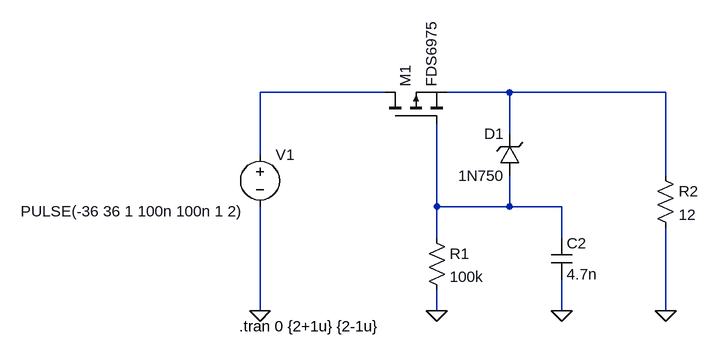
[diagram p0: schematic reverse_polarity_protection.asc]
reverse_polarity_protection.asc, the LTspice schematic file:
Version 4
SHEET 1 880 680
WIRE 80 80 -112 80
WIRE 272 80 176 80
WIRE 512 80 272 80
WIRE 272 144 272 80
WIRE -112 176 -112 80
WIRE 512 208 512 80
WIRE 160 256 160 128
WIRE 272 256 272 208
WIRE 272 256 160 256
WIRE 352 256 272 256
WIRE 160 304 160 256
WIRE 352 304 352 256
WIRE -112 416 -112 256
WIRE 160 416 160 384
WIRE 352 416 352 368
WIRE 512 416 512 288
FLAG 160 416 0
FLAG -112 416 0
FLAG 512 416 0
FLAG 352 416 0
SYMBOL pmos 80 128 R270
SYMATTR InstName M1
SYMATTR Value FDS6975
SYMBOL zener 288 208 R180
WINDOW 0 24 64 Left 2
WINDOW 3 24 0 Left 2
SYMATTR InstName D1
SYMATTR Value 1N750
SYMBOL res 144 288 R0
SYMATTR InstName R1
SYMATTR Value 100k
SYMBOL voltage -112 160 R0
WINDOW 123 0 0 Left 0
WINDOW 39 0 0 Left 0
WINDOW 3 -368 103 Left 2
SYMATTR InstName V1
SYMATTR Value PULSE(-36 36 1 100n 100n 1 2)
SYMBOL res 496 192 R0
SYMATTR InstName R2
SYMATTR Value 12
SYMBOL cap 336 304 R0
SYMATTR InstName C2
SYMATTR Value 4.7n
TEXT -144 440 Left 2 !.tran 0 {2+1u} {2-1u}

The netlist it stands for:
* reverse_polarity_protection.asc
M1 N001 N003 N002 N002 FDS6975
D1 N003 N002 1N750
R1 N003 0 100k
V1 N001 0 PULSE(-36 36 1 100n 100n 1 2)
R2 N002 0 12
C2 N003 0 4.7n
.model D D
.lib standard.dio
.model NMOS NMOS
.model PMOS PMOS
.lib standard.mos
.tran 0 {2+1u} {2-1u}
.backanno
.end